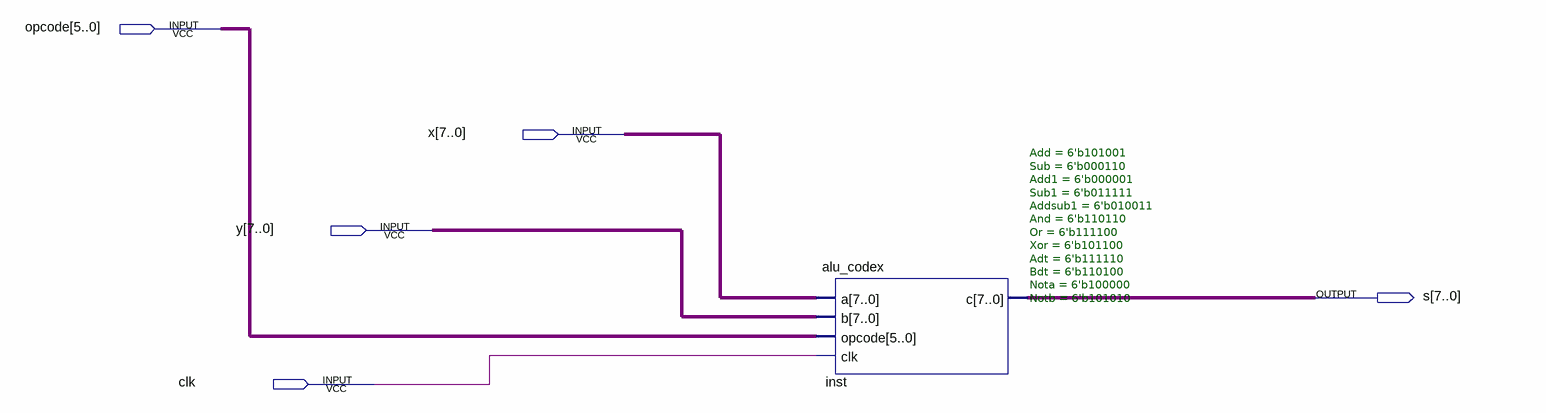
[diagram p0: schematic sheet]
// Quartus schematic cyalu.bdf as structural Verilog: 1 symbols, 5 pins
module cyalu (
  input  [5:0] opcode,
  input  [7:0] x,
  input  [7:0] y,
  input  clk,
  output [7:0] s
);

  alu_codex #(.Add(6'b101001), .Sub(6'b000110), .Add1(6'b000001), .Sub1(6'b011111), .Addsub1(6'b010011), .And(6'b110110), .Or(6'b111100), .Xor(6'b101100), .Adt(6'b111110), .Bdt(6'b110100), .Nota(6'b100000), .Notb(6'b101010)) inst (
    .a(x), .b(y), .opcode(opcode), .clk(clk), .c(s));
endmodule
